# EAGLE design DRAIVER (EAGLE 9.6.2)
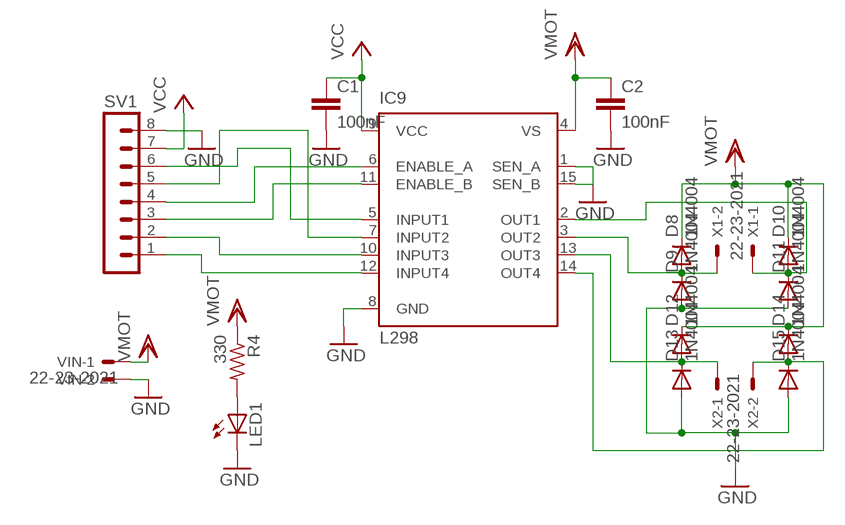
[diagram p0: schematic, sheet 1]

## Parts
C1  100nF  C-EU025-025X050  [C025-025X050]
C2  100nF  C-EU025-025X050  [C025-025X050]
D8  1N4004  [DO41-10]
D9  1N4004  [DO41-10]
D10  1N4004  [DO41-10]
D11  1N4004  [DO41-10]
D12  1N4004  [DO41-10]
D13  1N4004  [DO41-10]
D14  1N4004  [DO41-10]
D15  1N4004  [DO41-10]
IC9  L298  [MULTIWATT-15]
LED1  LED3MM  [LED3MM]
R4  330  R-US_0207/10  [0207/10]
SV1  MA08-1  [MA08-1]
VIN  22-23-2021  [22-23-2021]
X1  22-23-2021  [22-23-2021]
X2  22-23-2021  [22-23-2021]

## Nets
GND: C1.2 C2.2 D9.A D11.A D13.A D15.A IC9.1(SEN_A) IC9.8(GND) IC9.15(SEN_B) LED1.K(C) SV1.8 VIN.2
N$1: IC9.5(INPUT1) SV1.6
N$3: IC9.7(INPUT2) SV1.5
N$5: IC9.12(INPUT4) SV1.1
N$8: IC9.10(INPUT3) SV1.2
N$16: IC9.6(ENABLE_A) SV1.4
N$17: IC9.11(ENABLE_B) SV1.3
N$44: LED1.A R4.2
N$204: D8.A D9.C IC9.3(OUT2) X1.2
N$205: D10.A D11.C IC9.2(OUT1) X1.1
N$206: D12.A D13.C IC9.13(OUT3) X2.1
N$207: D14.A D15.C IC9.14(OUT4) X2.2
VCC: C1.1 IC9.9(VCC) SV1.7
VDD: C2.1 D8.C D10.C D12.C D14.C IC9.4(VS) R4.1 VIN.1 ; supply symbol labelled VMOT

## Library data of the parts
C1 C2 = rcl:C-EU: CAPACITOR, European symbol
D8-D15 = diode:1N4004: DIODE general purpose rectifier, 1 A
IC9 = st-microelectronics:L298: DUAL FULL-BRIDGE DRIVER
LED1 = led:LED: LED OSRAM: - CHIPLED LG R971, LG N971, LY N971, LG Q971, LY Q971, LO R971, LY R971 LH N974, LH R974 LS Q976, LO Q976, LY Q976 LO Q996 - Hyper CHIPLED LW Q18S LB Q993, LB Q99A, LB R99A - SideLED LS A670, LO A670, LY A670, LG A670, LP A670 LB A673, LV A673, LT A673, LW A673 LH A674 LY A675 LS A676, LA A676, LO A676, LY A676, LW A676 LS A679, LY A679, LG A679 - Hyper Micro SIDELED® LS Y876, LA Y876, LO Y876, LY Y876 LT Y87S - SmartLED LW L88C, LW L88S LB L89C, LB L89S, LG L890 LS L89K, LO L89K, LY L89K LS L896, LA L896, LO L896, LY L896 - TOPLED LS T670, LO T670, LY T670, LG T670, LP T670 LSG T670, LSP T670, LSY T670, LOP T670, LYG T670 LG T671, LOG T671, LSG T671 LB T673, LV T673, LT T673, LW T673 LH T674 LS T676, LA T676, LO T676, LY T676, LB T676, LH T676, LSB T676, LW T676 LB T67C, LV T67C, LT T67C, LS T67K, LO T67K, LY T67K, LW E67C LS E67B, LA E67B, LO E67B, LY E67B, LB E67C, LV E67C, LT E67C LW T67C LS T679, LY T679, LG T679 LS T770, LO T770, LY T770, LG T770, LP T770 LB T773, LV T773, LT T773, LW T773 LH T774 LS E675, LA E675, LY E675, LS T675 LS T776, LA T776, LO T776, LY T776, LB T776 LHGB T686 LT T68C, LB T68C - Hyper Mini TOPLED® LB M676 - Mini TOPLED Santana® LG M470 LS M47K, LO M47K, LY M47K Source: http://www.osram.convergy.de LUXEON: - LUMILED® LXK2-PW12-R00, LXK2-PW12-S00, LXK2-PW14-U00, LXK2-PW14-V00 LXK2-PM12-R00, LXK2-PM12-S00, LXK2-PM14-U00 LXK2-PE12-Q00, LXK2-PE12-R00, LXK2-PE12-S00, LXK2-PE14-T00, LXK2-PE14-U00 LXK2-PB12-K00, LXK2-PB12-L00, LXK2-PB12-M00, LXK2-PB14-N00, LXK2-PB14-P00, LXK2-PB14-Q00 LXK2-PR12-L00, LXK2-PR12-M00, LXK2-PR14-Q00, LXK2-PR14-R00 LXK2-PD12-Q00, LXK2-PD12-R00, LXK2-PD12-S00 LXK2-PH12-R00, LXK2-PH12-S00 LXK2-PL12-P00, LXK2-PL12-Q00, LXK2-PL12-R00 Source: www.luxeon.com KINGBRIGHT: KA-3528ASYC Source: www.kingbright.com
R4 = rcl:R-US_: RESISTOR, American symbol
SV1 = con-lstb:MA08-1: PIN HEADER; OC_FARNELL: unknown; OC_NEWARK: unknown
VIN X1 X2 = con-molex:22-23-2021: .100" (2.54mm) Center Header - 2 Pin; MF: MOLEX; MPN: 22-23-2021; OC_FARNELL: 1462926; OC_NEWARK: 25C3832

## Board
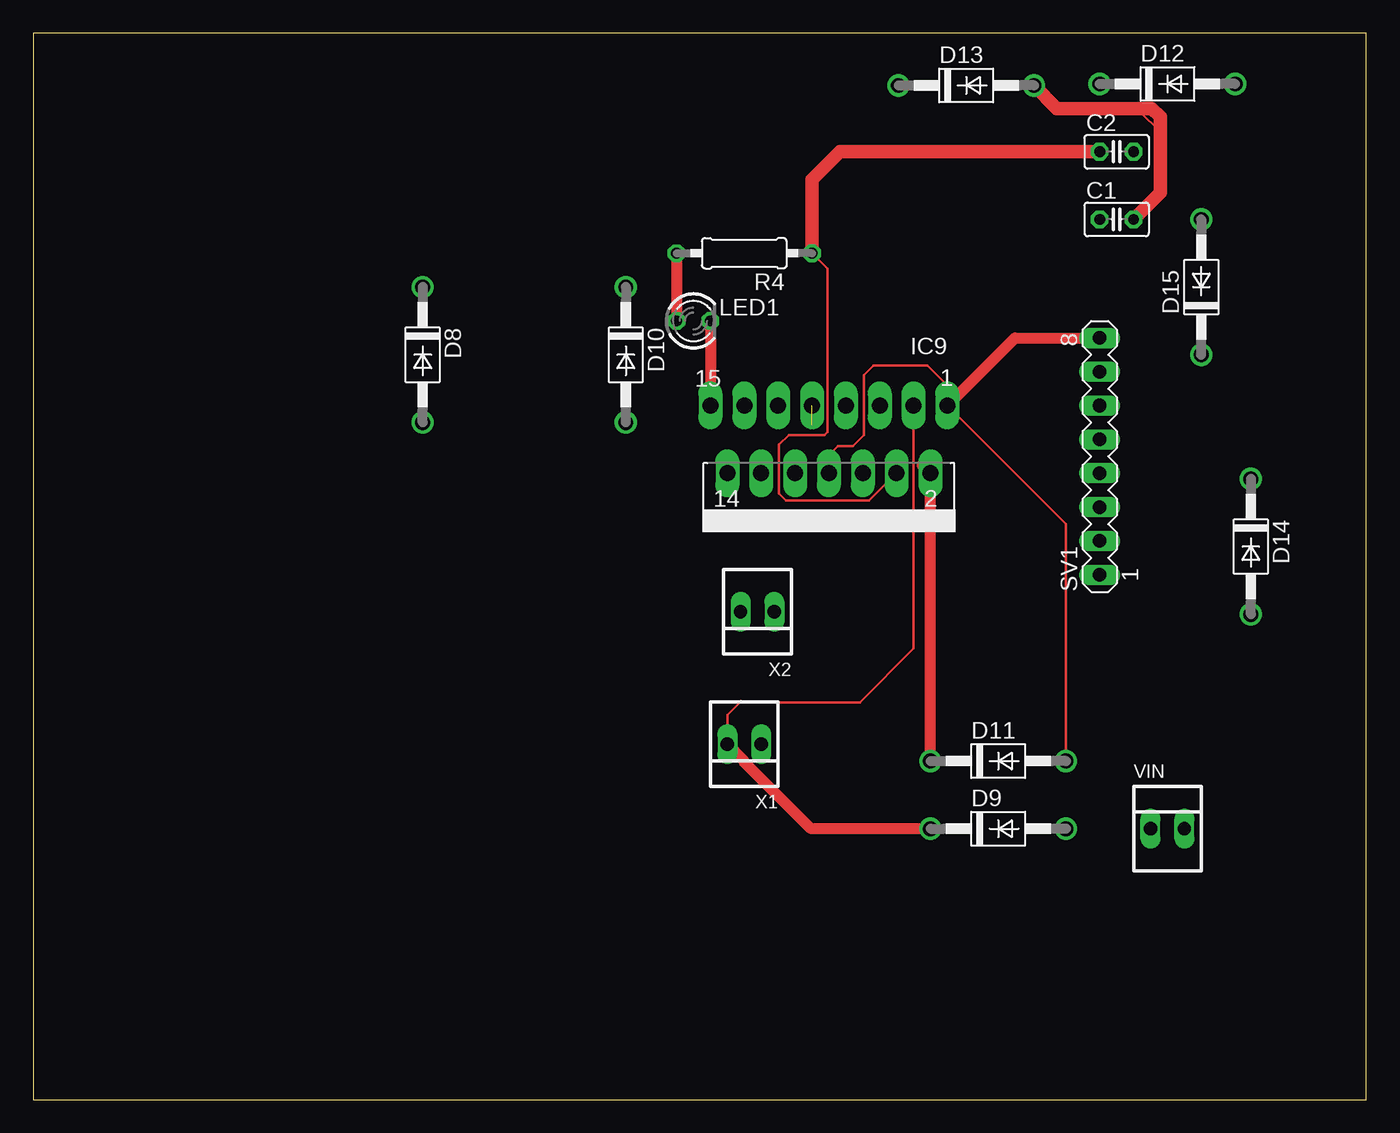
[diagram p1: board, top side]
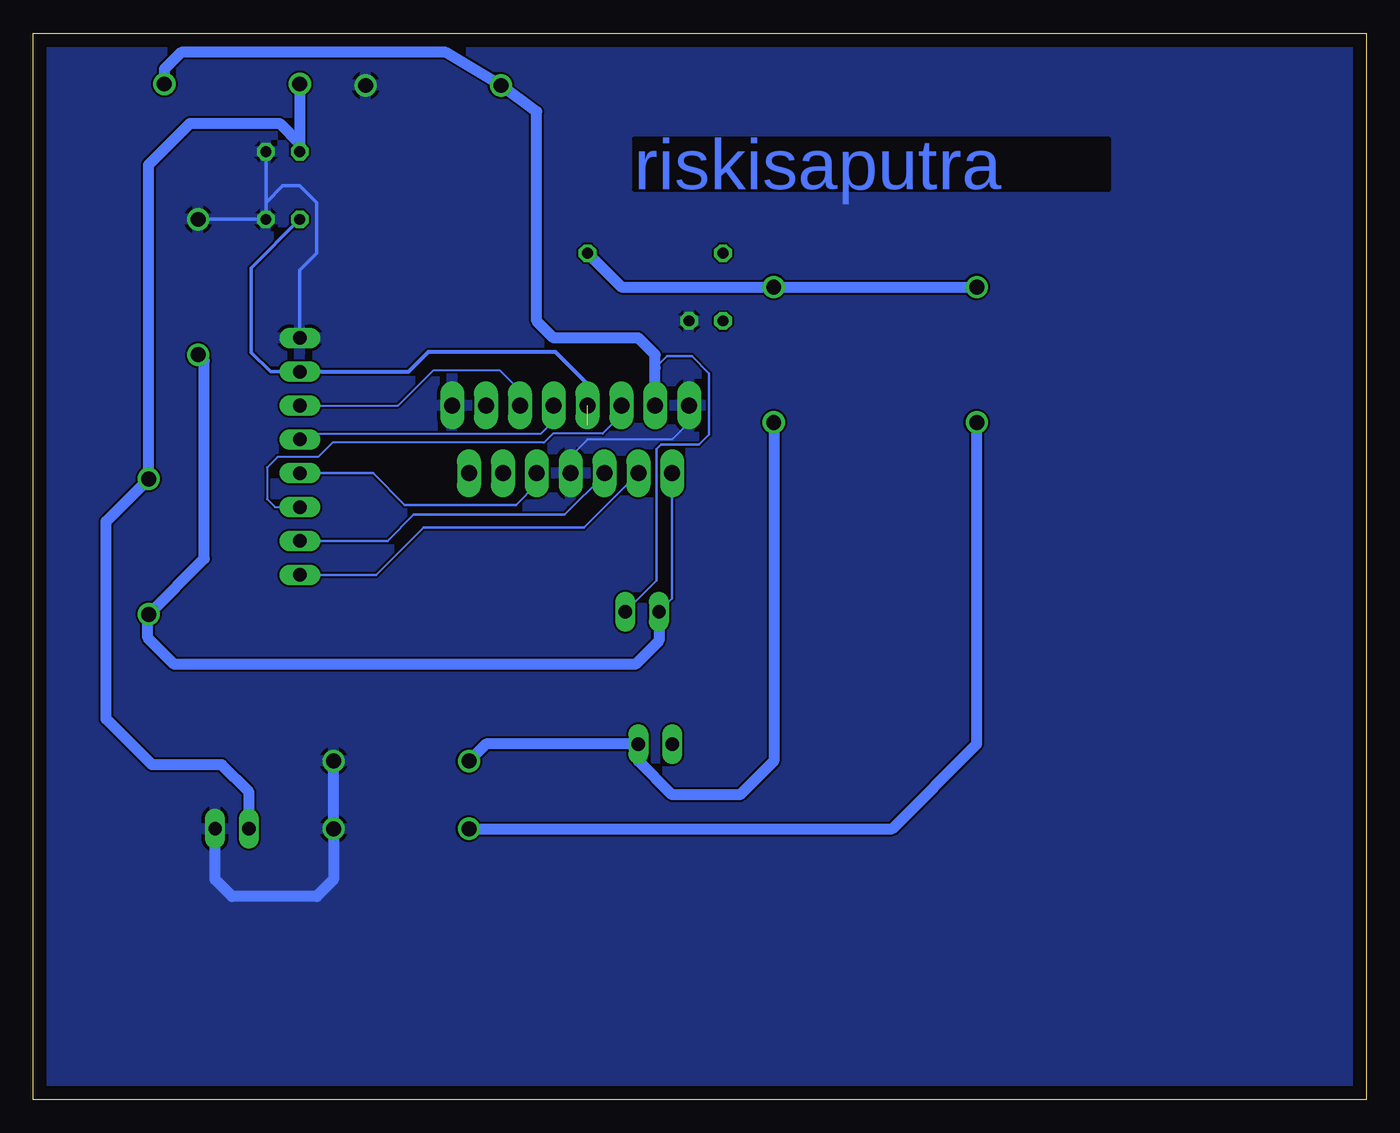
[diagram p2: board, bottom side, seen from below]

Size 100 x 80 mm. Coordinates in mm from the lower left corner, seen from the top.
Outline: 0,0 100,0 100,80 0,80 0,0
Copper layers (1*16): Top 0.035mm / dielectric 1.5mm / Bottom 0.035mm
Design rules "default": minimum track width 6mil, minimum drill 0.35mm, track to track 6mil, track to pad 6mil, pad to pad 6mil, via to via 6mil, smd to smd 6mil, copper to edge 40mil, drill to drill 6mil, minimum pad ring 10mil, minimum via ring 8mil, stop-mask expansion 4mil, vias tented up to drill 0mil, thermal gap 10mil

### Footprints (pad centres in the part's own frame; a part is rotated, then mirrored left to right if it is on the bottom)
C025-025X050 = drill 0.813 octagon: 1 -1.27,0; 2 1.27,0
DO41-10 = drill 1.118: A 5.08,0; C -5.08,0
MULTIWATT-15 = drill 1.2 long: 1 -8.89,-7.62; 2 -7.62,-2.54; 3 -6.35,-7.62; 4 -5.08,-2.54; 5 -3.81,-7.62; 6 -2.54,-2.54; 7 -1.27,-7.62; 8 0,-2.54; 9 1.27,-7.62; 10 2.54,-2.54; 11 3.81,-7.62; 12 5.08,-2.54; 13 6.35,-7.62; 14 7.62,-2.54; 15 8.89,-7.62
LED3MM = drill 0.813 octagon: A -1.27,0; K 1.27,0
0207/10 = drill 0.813 octagon: 1 -5.08,0; 2 5.08,0
MA08-1 = drill 1.016 long: 1 -8.89,0; 2 -6.35,0; 3 -3.81,0; 4 -1.27,0; 5 1.27,0; 6 3.81,0; 7 6.35,0; 8 8.89,0
22-23-2021 = drill 1 long: 1 -1.27,0; 2 1.27,0

### Placement (x,y rotation side)
C1  81.28,66.04 0 top
C2  81.28,71.12 0 top
D8  29.21,55.88 270 top
D9  72.39,20.32 0 top
D10  44.45,55.88 270 top
D11  72.39,25.4 0 top
D12  85.09,76.2 0 top
D13  69.99,76.09 0 top
D14  91.34,41.48 270 top
D15  87.63,60.96 90 top
IC9  59.69,44.45 180 top
LED1  49.53,58.42 0 top
R4  53.34,63.5 180 top
SV1  80.01,48.26 90 top
VIN  85.09,20.32 0 top
X1  53.34,26.67 180 top
X2  54.33,36.6 180 top

### Tracks (layer width: path | path; a pad name or v marks a point on that pad's centre or on a via)
GND
  Top 0.152: 68.67,51.98 IC9.1
  Top 0.2: 84.78,72.39 84.55,72.61 83.07,74.1 | 77.06,74.1 D13.A | IC9.8 59.69,48.35 60.38,49.03 61.48,49.03 62.32,49.87 62.32,54.36 63.04,55.09 67.08,55.09 68.58,53.58 IC9.1 77.47,43.18 D11.A
  Top 0.813: LED1.K IC9.15 | IC9.1 73.66,57.15 SV1.8
  Top 1.016: D13.A 76.8,74.36 83.92,74.36 84.55,73.73 84.55,72.61 84.55,68.04 C1.2
  Bottom 0.152: IC9.15 50.8,50.8 52.07,49.53 58.42,49.53 59.69,48.26 IC9.8
  Bottom 0.254: SV1.8 80.01,62.23 78.74,63.5 78.74,67.31 80.01,68.58 81.28,68.58 82.55,67.31 C1.2 | C1.2 C2.2 | C1.2 D15.A
  Bottom 0.813: VIN.2 86.36,16.51 85.09,15.24 78.74,15.24 77.47,16.51 D9.A D11.A
  pour Bottom: 0.33,0 99.97,0 100.46,0.49 100.46,79.78 100.08,80.16 0.18,80.16 0,79.98 0,0.46 0.39,0.07 0.33,0.07 0.26,0
N$1
  Bottom 0.152: SV1.6 72.63,52.07 69.98,54.72 65.01,54.72 63.5,53.21 IC9.5
N$3
  Bottom 0.152: IC9.7 60.96,50.92 61.94,49.95 79.59,49.95 SV1.5
N$5
  Bottom 0.2: SV1.1 74.28,39.37 70.73,42.92 58.68,42.92 IC9.12
N$8
  Bottom 0.2: SV1.2 73.44,41.91 71.47,43.88 60.13,43.88 57.15,46.86 IC9.10
N$16
  Bottom 0.2: IC9.6 62.23,46.17 63.79,44.61 72.13,44.61 74.51,46.99 SV1.4
N$17
  Bottom 0.152: IC9.11 55.88,51.36 57.28,49.96 61.02,49.96 61.69,49.29 77.55,49.29 78.63,48.21 81.67,48.21 82.46,47.42 82.46,45.04 81.86,44.44 80.02,44.44 SV1.3
N$44
  Top 0.813: R4.2 LED1.A
N$204
  Top 0.2: X1.2 52.07,28.87 53.01,29.81 | 53.01,29.81 53.09,29.89 | 53.01,29.81 62.02,29.81 66.05,33.84 | 66.05,33.84 | IC9.3 66.05,33.84
  Top 0.813: X1.2 53.3,25.44 53.3,25.37 58.35,20.32 D9.C
  Bottom 0.813: D9.C 35.56,20.32 29.21,26.67 D8.A
N$205
  Top 0.813: D11.C IC9.2 | IC9.2 66.7,47.6 66.7,47.61 67.31,47 IC9.2
  Bottom 0.813: D10.A 44.45,25.4 46.99,22.86 52.07,22.86 54.61,25.4 X1.1 66.04,26.67 D11.C
N$206
  Bottom 0.2: X2.1 53.24,38.95 53.24,48.81 52.92,49.14 50.06,49.14 49.3,49.89 49.3,54.48 50.58,55.76 52.47,55.76 53.34,54.9
  Bottom 0.813: D12.A 90.17,77.31 88.9,78.58 69.04,78.58 D13.C 62.23,74.14 62.23,58.42 60.96,57.15 54.61,57.15 53.34,55.88 53.34,54.9 IC9.13
N$207
  Bottom 0.2: X2.2 52.07,37.59 IC9.14
  Bottom 0.813: D15.C 87.17,55.42 87.17,40.58 D14.A 91.4,36.34 91.4,34.63 89.43,32.66 54.83,32.66 53.06,34.42 X2.2
VCC  (1 unrouted)
  Bottom 0.254: SV1.7 82.11,54.61 82.21,54.61 83.66,56.06 83.66,62.39 C1.1 | 58.42,50.62 58.35,50.55
  Bottom 0.305: SV1.7 71.85,54.61 70.35,56.11 60.85,56.11 58.15,53.41 58.15,52.34 IC9.9
VDD
  Top 0.2: IC9.4 62.71,44.94 58.46,44.94 58.45,44.93 56.48,44.93 55.95,45.45 55.95,49.13 56.68,49.86 59.35,49.86 59.59,50.1 59.59,62.33 R4.1
  Top 1.016: R4.1 58.42,69.03 60.51,71.12 C2.1
  Bottom 0.813: D8.C D10.C 55.88,60.96 R4.1 | D12.C 80.01,71.72 | 80.01,71.72 C2.1 | 80.01,71.72 81.53,73.24 88.25,73.24 91.34,70.14 D14.C 94.54,43.37 94.54,28.55 91.1,25.11 85.86,25.11 83.82,23.08 VIN.1

### Text on the board
Bottom: riskisaputra